# EAGLE design ds1307_brkout (EAGLE 7.2.0)
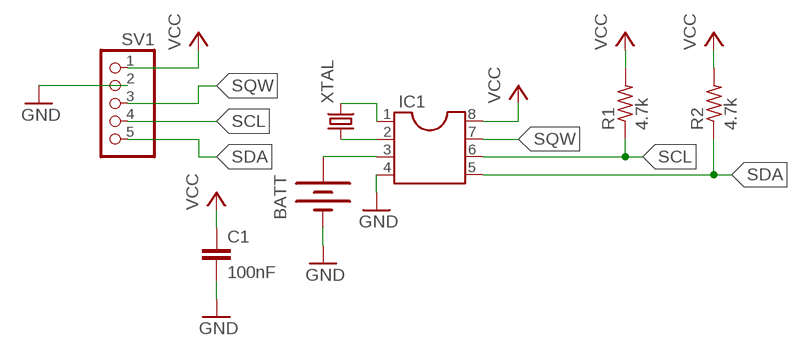
[diagram p0: schematic, sheet 1]

## Parts
BATT  BATTERY20PTH  [BATTCOM_20MM_PTH]
C1  100nF  C2.5/5  [C2.5-5]
IC1  DIL8S  [SOCKET-08]
R1  4.7k  R-US_0207/12  [0207/12]
R2  4.7k  R-US_0207/12  [0207/12]
SV1  PINHD-1X5  [1X05]
XTAL  CRYSTALTC26H  [TC26H]

## Nets
GND: BATT.2(-) C1.2 IC1.4 SV1.2
N$1: IC1.1 XTAL.2
N$2: IC1.2 XTAL.1
N$3: BATT.1(+) IC1.3
SCL: IC1.6 R1.1 SV1.4
SDA: IC1.5 R2.1 SV1.5
SQW: IC1.7 SV1.3
VCC: C1.1 IC1.8 R1.2 R2.2 SV1.1

## Library data of the parts
BATT = SparkFun-Electromechanical:BATTERY: Battery Holders Various common sizes : AA, AAA, 18650 (PRT-12895), 20mm coin cell and 12mm coin cell. 20MM_4LEGS, BATT-10373
C1 = capacitor-wima:C: CAPACITOR naming: grid - package width
IC1 = ic-package:DIL8: Dual In Line / Socket
R1 R2 = resistor:R-US_: RESISTOR, American symbol
SV1 = pinhead:PINHD-1X5: PIN HEADER
XTAL = crystal:CRYSTAL: CRYSTAL; OC_FARNELL: unknown; OC_NEWARK: unknown

## Board
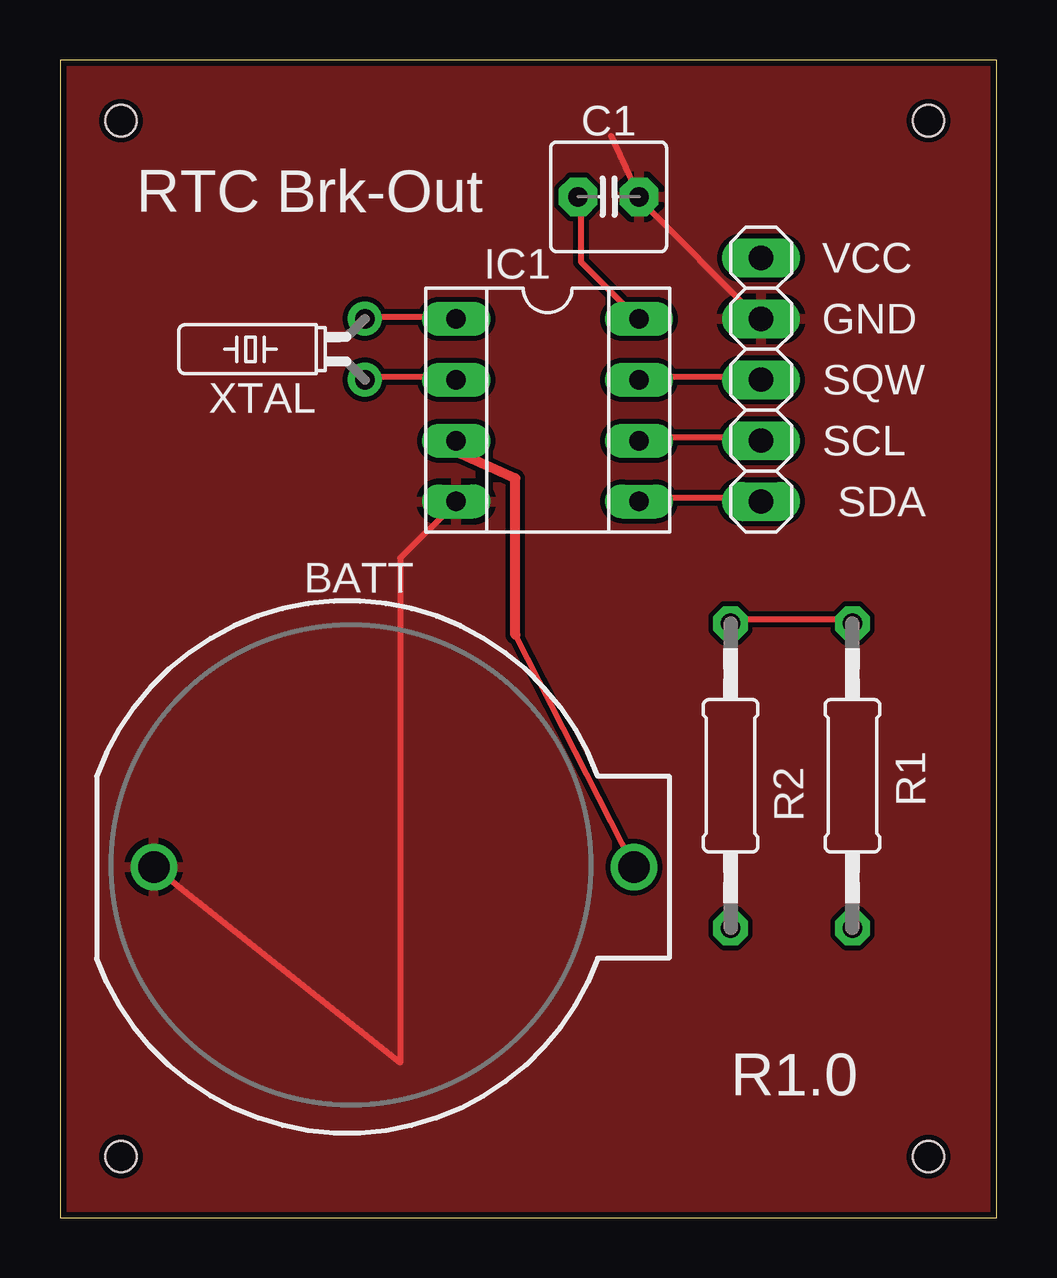
[diagram p1: board, top side]
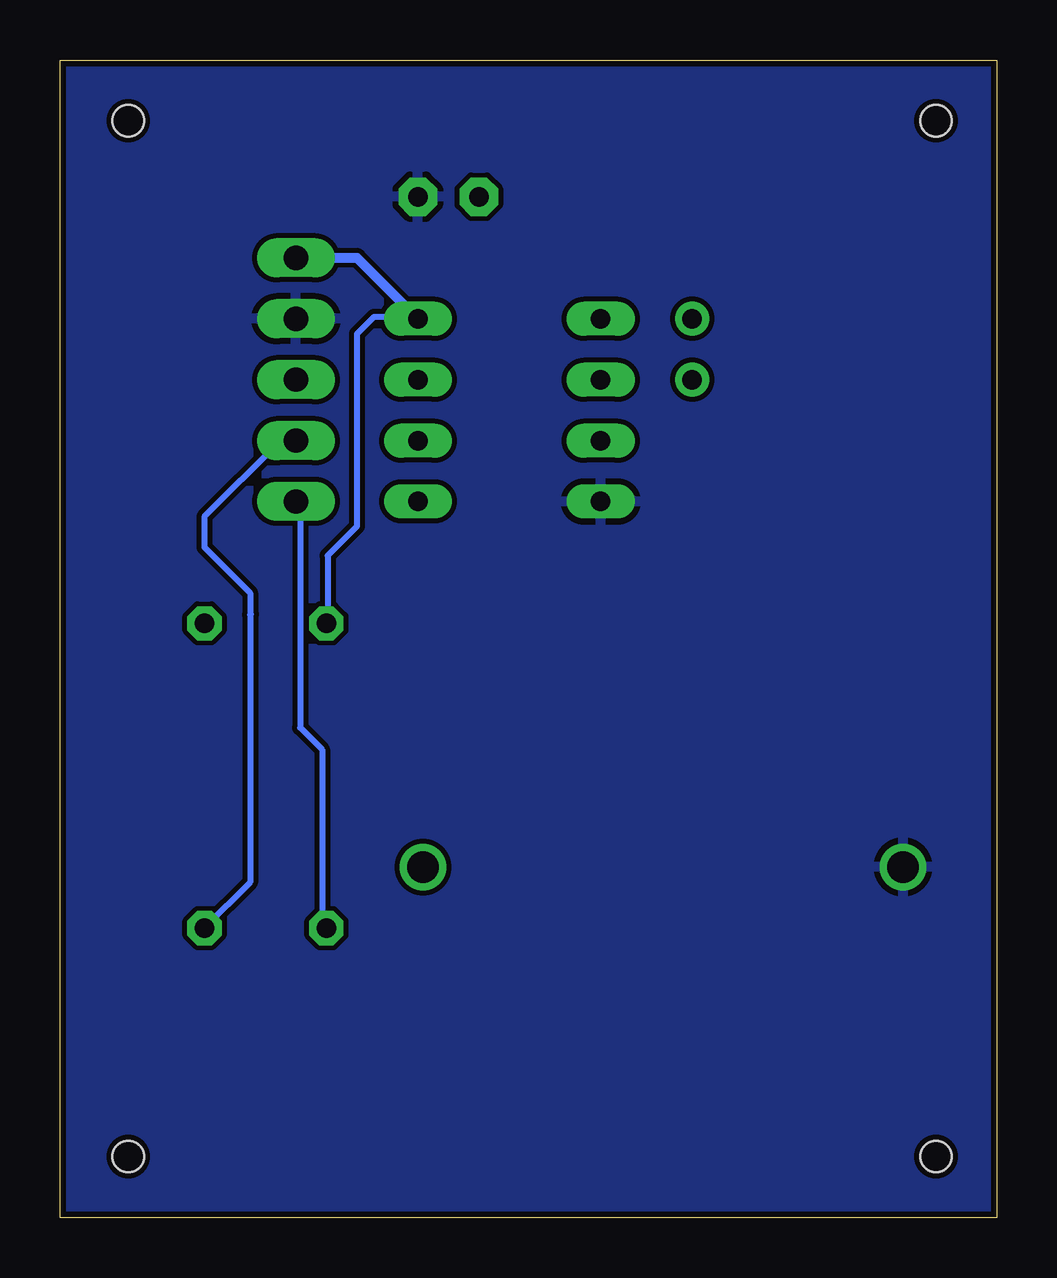
[diagram p2: board, bottom side, seen from below]

Size 39.04 x 48.25 mm. Coordinates in mm from the lower left corner, seen from the top.
Outline: 0,0 39.04,0 39.04,48.25 0,48.25 0,0
Copper layers (1*16): Top 0.035mm / dielectric 1.5mm / Bottom 0.035mm
Design rules "SparkFun": minimum track width 8mil, minimum drill 20mil, track to track 8mil, track to pad 8mil, pad to pad 8mil, via to via 8mil, smd to smd 8mil, copper to edge 10mil, drill to drill 8mil, minimum pad ring 12mil, minimum via ring 10mil, stop-mask expansion 4mil, vias tented up to drill 25mil, thermal gap 10mil
Holes 1.3 mm at 2.54,45.72 36.2,45.72 36.2,2.54 2.54,2.54

### Footprints (pad centres in the part's own frame; a part is rotated, then mirrored left to right if it is on the bottom)
BATTCOM_20MM_PTH = drill 1.3: 1 11.85,0; 2 -8.15,0
C2.5-5 = drill 0.813 pad 1.6 octagon: 1 -1.27,0; 2 1.27,0
SOCKET-08 = drill 0.813 long: 1 -3.81,-3.81; 2 -1.27,-3.81; 3 1.27,-3.81; 4 3.81,-3.81; 5 3.81,3.81; 6 1.27,3.81; 7 -1.27,3.81; 8 -3.81,3.81
0207/12 = drill 0.813 octagon: 1 -6.35,0; 2 6.35,0
1X05 = drill 1.016 long: 1 -5.08,0; 2 -2.54,0; 3 0,0; 4 2.54,0; 5 5.08,0
TC26H = drill 0.813: 1 -1.27,0; 2 1.27,0

### Placement (x,y rotation side)
BATT  12.06,14.61 0 top
C1  22.86,42.55 0 top
IC1  20.32,33.66 270 top
R1  33.02,18.41 90 top
R2  27.94,18.41 90 top
SV1  29.21,34.93 270 top
XTAL  12.7,36.2 90 top

### Tracks (layer width: path | path; a pad name or v marks a point on that pad's centre or on a via)
GND
  Top 0.254: SV1.2 29.03,37.54 24.23,42.34 22.96,45.09 C1.2 | BATT.2 14.17,6.45 14.17,27.48 16.46,29.77 IC1.4
  pour Bottom: -1.27,52.07 40.64,52.07 40.64,-2.54 40.64,-3.81 -1.27,-3.81
  pour Top: -2.54,53.34 41.91,53.34 41.91,-3.81 -2.54,-3.81
N$1
  Top 0.254: XTAL.2 12.8,37.54 16.46,37.54 IC1.1
N$2
  Top 0.254: XTAL.1 12.8,35.03 16.46,35.03 IC1.2
N$3
  Top 0.254: 18.97,24.28 BATT.1
  Top 0.406: 18.97,24.28 18.97,30.81 16.69,31.83 16.69,32.28 IC1.3
SCL
  Top 0.254: IC1.6 24.23,32.51 29.03,32.51 SV1.4
  Bottom 0.254: 31.09,25.15 31.11,25.12 | 32.92,12.12 R1.1 31.11,13.97 31.11,25.12 | SV1.4 29.26,32.28 29.95,32.28 33.02,29.21 33.02,27.94 31.11,26.04 31.11,25.12
SDA
  Top 0.254: IC1.5 24.23,30 29.03,30 SV1.5
  Bottom 0.254: R2.1 28.12,12.12 28.12,19.51 29.03,20.42 29.03,29.77 SV1.5
SQW
  Top 0.254: IC1.7 24.23,35.03 29.03,35.03 SV1.3
VCC
  Top 0.254: R2.2 28.12,24.92 32.92,24.92 R1.2 | IC1.8 24,37.54 21.72,39.83 21.72,42.42 C1.1
  Bottom 0.254: IC1.8 24.23,37.54 25.96,37.54 26.67,36.83 26.67,28.8 27.89,27.58 27.89,24.92 R2.2
  Bottom 0.406: SV1.1 26.67,40.01 IC1.8

### Text on the board
tPlace: RTC Brk-Out | VCC | GND | SQW | SCL | SDA | R1.0